# EAGLE design mini-v1.3 (EAGLE 7.2.0)

## Sheet 1 of 4: Main Microcontroller
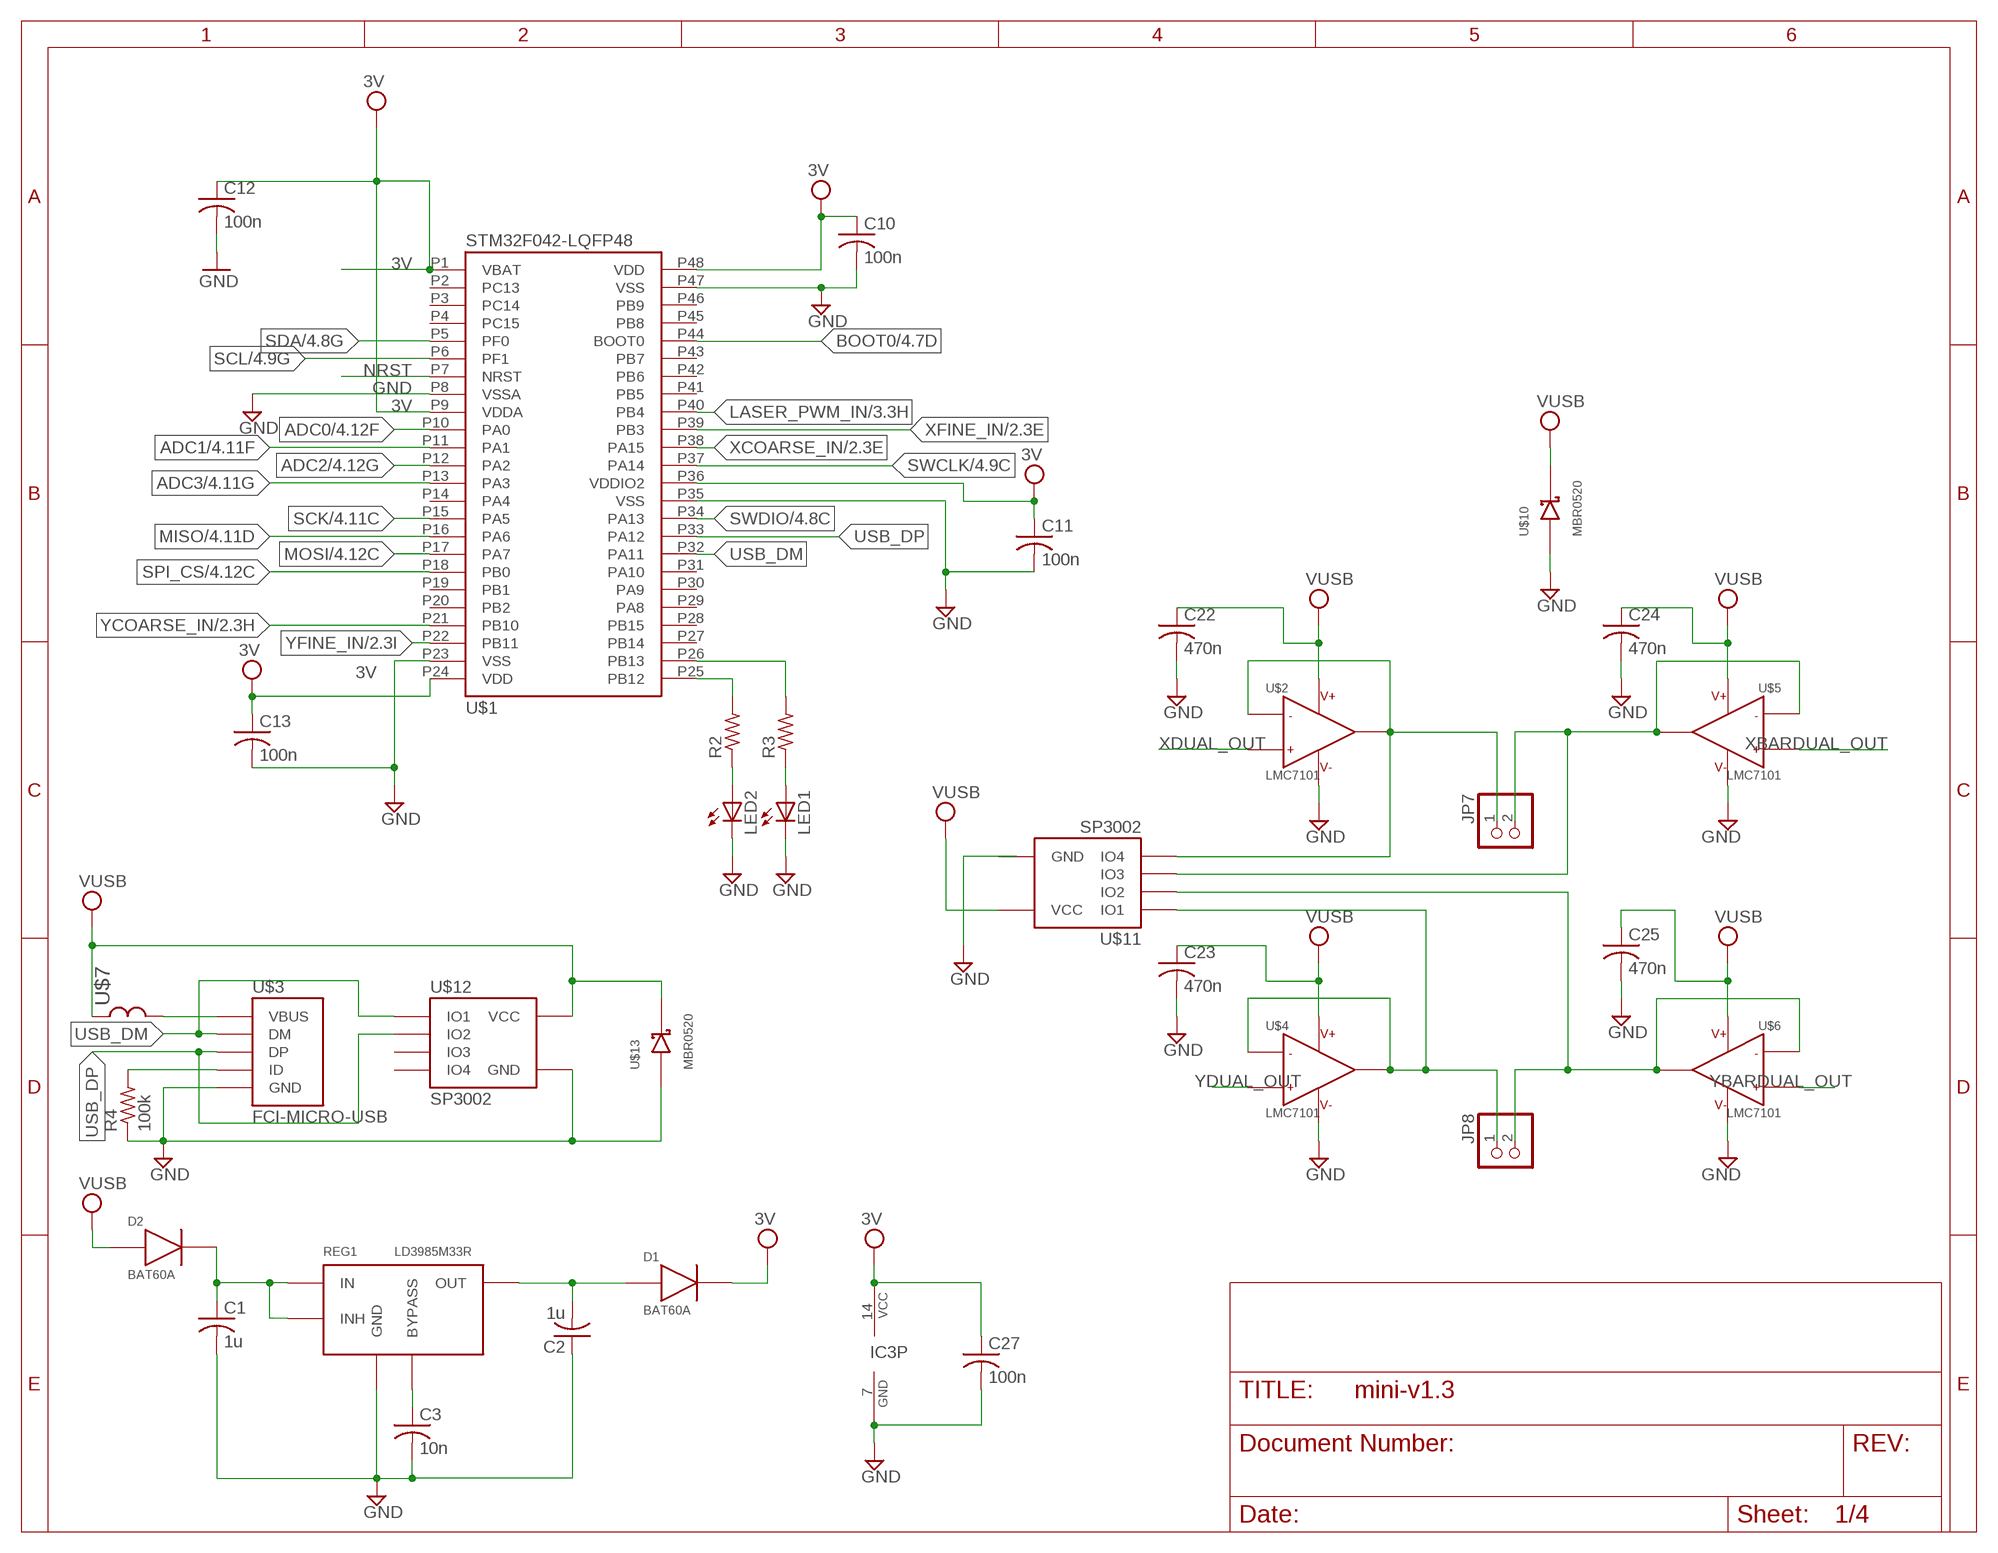
[diagram p0: schematic, sheet 1]

### Parts
C1  1u  C-USC0603  [C0603]
C2  1u  C-USC0603  [C0603]
C3  10n  C-USC0603  [C0603]
C10  100n  C-USC0603  [C0603]
C11  100n  C-USC0603  [C0603]
C12  100n  C-USC0603  [C0603]
C13  100n  C-USC0603  [C0603]
C22  470n  C-USC0603  [C0603]
C23  470n  C-USC0603  [C0603]
C24  470n  C-USC0603  [C0603]
C25  470n  C-USC0603  [C0603]
C27  100n  C-USC0603  [C0603]
D1  BAT60A  [SOD323]
D2  BAT60A  [SOD323]
IC3  74S04D  [SO14]
JP7  PINHD-1X2  [1X02]
JP8  PINHD-1X2  [1X02]
LED1  LEDCHIP-LED0603  [CHIP-LED0603]
LED2  LEDCHIP-LED0603  [CHIP-LED0603]
R2  R-US_R0603  [R0603]
R3  R-US_R0603  [R0603]
R4  100k  R-US_R0603  [R0603]
REG1  LD3985M33R  LD3985MXXR  [SOT23-5L]
U$1  STM32F042-LQFP48  [LQFP48]
U$2  LMC7101  [SOT23-5]
U$3  FCI-MICRO-USB  [FCI-MICROUSB]
U$4  LMC7101  [SOT23-5]
U$5  LMC7101  [SOT23-5]
U$6  LMC7101  [SOT23-5]
U$7  L_TDK_1005  [MLK1005]
U$10  MBR0520  [SOD123]
U$11  SP3002  [SC70-6]
U$12  SP3002  [SC70-6]
U$13  MBR0520  [SOD123]

### Nets
3V: C10.1 C11.1 C12.1 C13.1 C27.1 D1.1 IC3.14(P:VCC) U$1.P1(VBAT) U$1.P9(VDDA) U$1.P24(VDD) U$1.P36(VDDIO2) U$1.P48(VDD) ; also sheet 4
3V3: C2.2 D1.2 REG1.OUT
ADC0: U$1.P10(PA0) ; also sheet 4
ADC1: U$1.P11(PA1) ; also sheet 4
ADC2: U$1.P12(PA2) ; also sheet 4
ADC3: U$1.P13(PA3) ; also sheet 4
BOOT0: U$1.P44(BOOT0) ; also sheet 4
GND [Power]: C1.2 C2.1 C3.2 C10.2 C11.2 C12.2 C13.2 C22.2 C23.2 C24.2 C25.2 C27.2 IC3.7(P:GND) LED1.C LED2.C R4.1 REG1.GND U$1.P8(VSSA) U$1.P23(VSS) U$1.P35(VSS) U$1.P47(VSS) U$2.5 U$3.P5(GND) U$4.5 U$5.5 U$6.5 U$10.ANODE U$12.P2(GND) U$13.ANODE ; also sheet 2,3,4
LASER_PWM_IN: U$1.P40(PB4) ; also sheet 3
MISO: U$1.P16(PA6) ; also sheet 4
MOSI: U$1.P17(PA7) ; also sheet 4
N$1: C3.1 REG1.BYPASS
N$2: R2.2 U$1.P25(PB12)
N$3: LED2.A R2.1
N$4: C1.1 D2.1 REG1.IN REG1.INHIBIT(INH)
N$5: R4.2 U$3.P4(ID)
N$7: JP7.1 U$2.1 U$2.4 U$11.P6(IO4)
N$9: JP8.1 U$4.1 U$4.4 U$11.P1(IO1)
N$12: LED1.A R3.1
N$13: R3.2 U$1.P26(PB13)
N$14: U$3.P1(VBUS) U$7.P$2
N$16: JP7.2 U$5.1 U$5.4 U$11.P4(IO3)
N$17: JP8.2 U$6.1 U$6.4 U$11.P3(IO2)
NRST: U$1.P7(NRST) ; also sheet 4
SCK: U$1.P15(PA5) ; also sheet 4
SCL: U$1.P6(PF1) ; also sheet 4
SDA: U$1.P5(PF0) ; also sheet 4
SPI_CS: U$1.P18(PB0) ; also sheet 4
SWCLK: U$1.P37(PA14) ; also sheet 4
SWDIO: U$1.P34(PA13) ; also sheet 4
USB_DM: U$1.P32(PA11) U$3.P2(DM) U$12.P1(IO1)
USB_DP: U$1.P33(PA12) U$3.P3(DP) U$12.P3(IO2)
VUSB [Power]: C22.1 C23.1 C24.1 C25.1 D2.2 U$2.2 U$4.2 U$5.2 U$6.2 U$7.P$1 U$10.CATHODE U$11.P5(VCC) U$12.P5(VCC) U$13.CATHODE ; also sheet 3
XBARDUAL_OUT: U$5.3 ; also sheet 2
XCOARSE_IN: U$1.P38(PA15) ; also sheet 2
XDUAL_OUT: U$2.3 ; also sheet 2
XFINE_IN: U$1.P39(PB3) ; also sheet 2
YBARDUAL_OUT: U$6.3 ; also sheet 2
YCOARSE_IN: U$1.P21(PB10) ; also sheet 2
YDUAL_OUT: U$4.3 ; also sheet 2
YFINE_IN: U$1.P22(PB11) ; also sheet 2
Unconnected: IC3.1(A:I) IC3.2(A:O) IC3.3(B:I) IC3.4(B:O) U$1.P2(PC13) U$1.P3(PC14) U$1.P4(PC15) U$1.P14(PA4) U$1.P19(PB1) U$1.P20(PB2) U$1.P27(PB14) U$1.P28(PB15) U$1.P29(PA8) U$1.P30(PA9) U$1.P31(PA10) U$1.P41(PB5) U$1.P42(PB6) U$1.P43(PB7) U$1.P45(PB8) U$1.P46(PB9) U$12.P4(IO3) U$12.P6(IO4)

## Sheet 2 of 4: Dual PWM
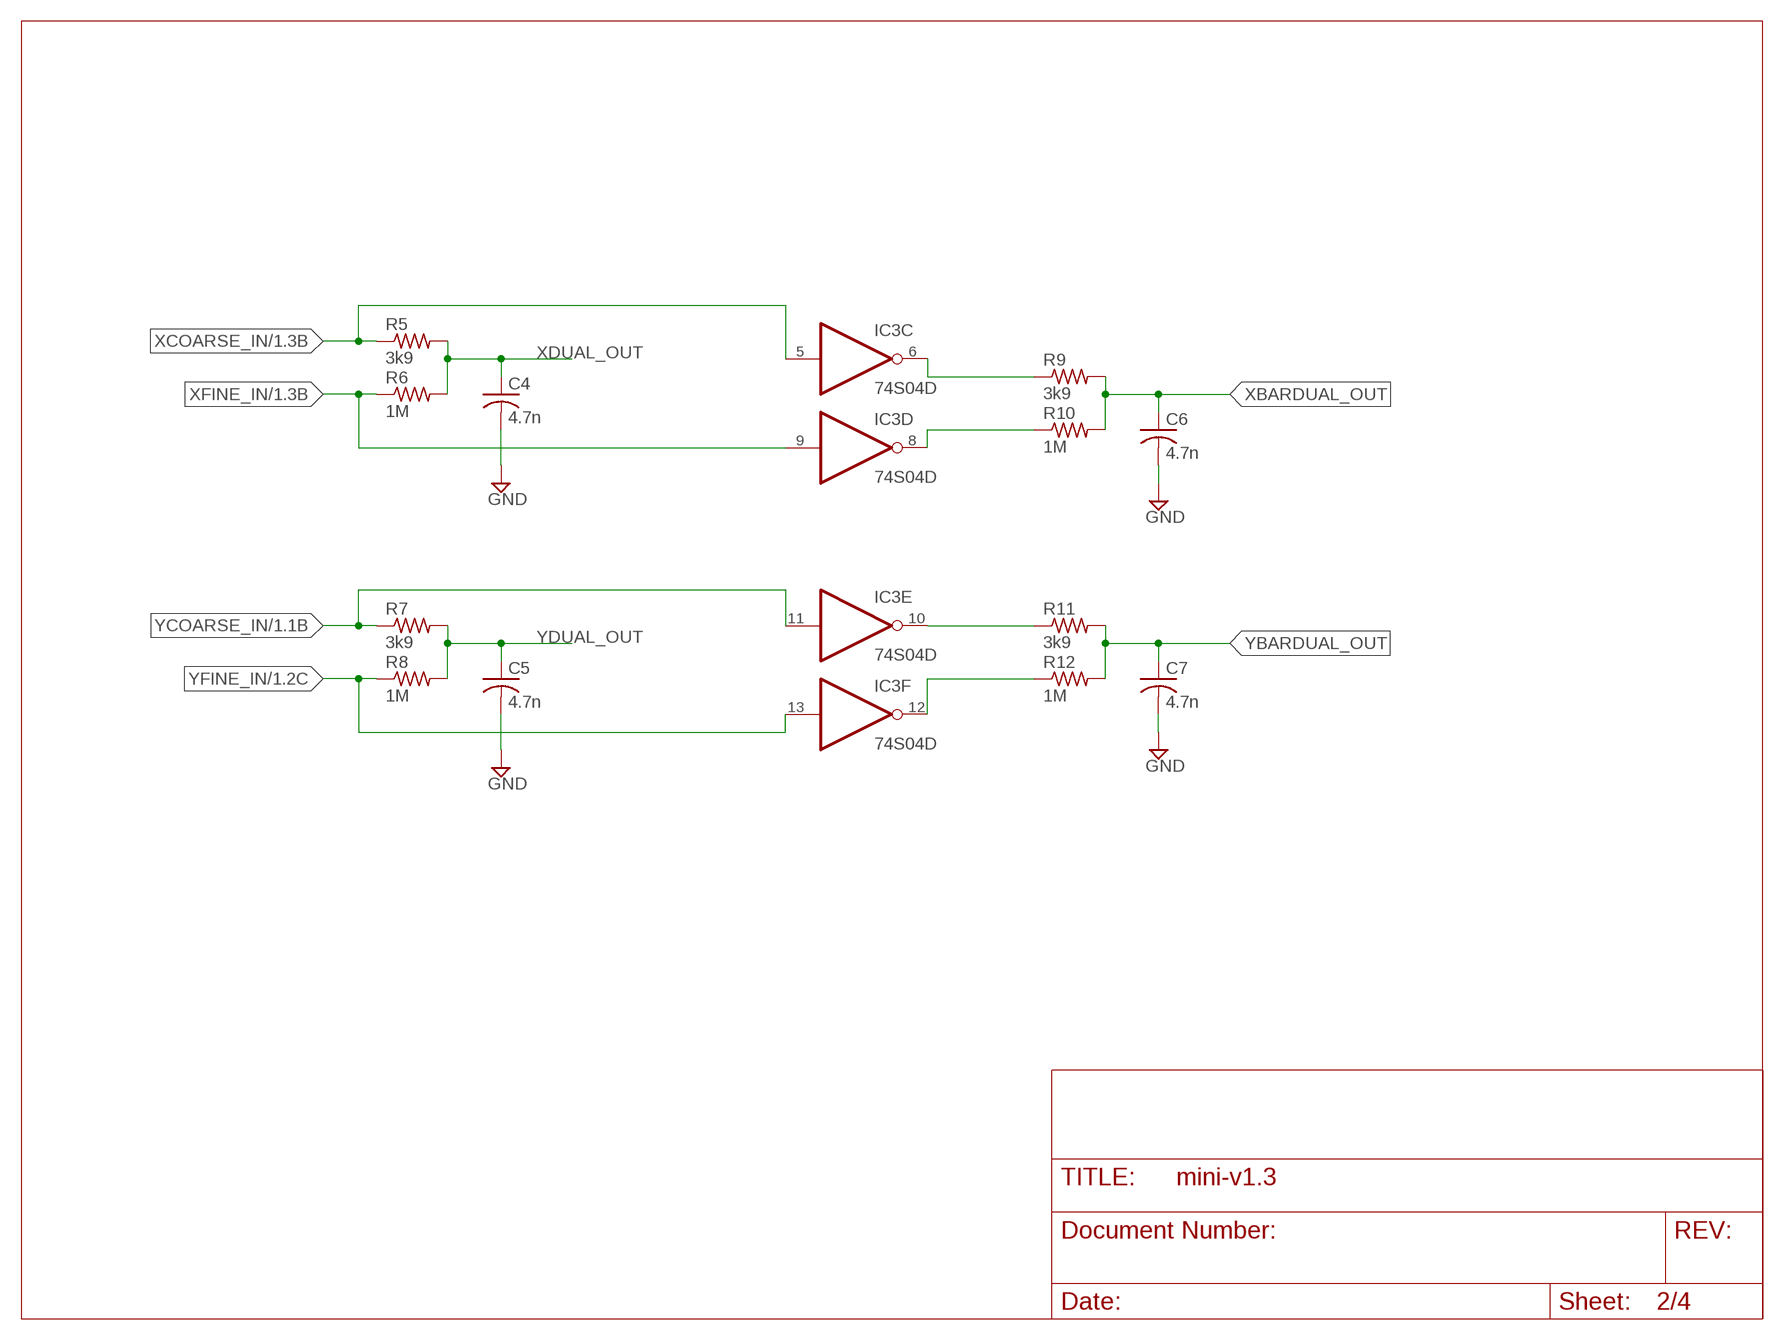
[diagram p1: schematic, sheet 2]

### Parts
C4  4.7n  C-USC0603  [C0603]
C5  4.7n  C-USC0603  [C0603]
C6  4.7n  C-USC0603  [C0603]
C7  4.7n  C-USC0603  [C0603]
R5  3k9  R-US_R0603  [R0603]
R6  1M  R-US_R0603  [R0603]
R7  3k9  R-US_R0603  [R0603]
R8  1M  R-US_R0603  [R0603]
R9  3k9  R-US_R0603  [R0603]
R10  1M  R-US_R0603  [R0603]
R11  3k9  R-US_R0603  [R0603]
R12  1M  R-US_R0603  [R0603]

### Nets
GND [Power]: C4.2 C5.2 C6.2 C7.2 ; also sheet 1,3,4
N$6: IC3.10(E:O) R11.1
N$8: IC3.12(F:O) R12.1
N$10: IC3.8(D:O) R10.1
N$11: IC3.6(C:O) R9.1
XBARDUAL_OUT: C6.1 R9.2 R10.2 ; also sheet 1
XCOARSE_IN: IC3.5(C:I) R5.1 ; also sheet 1
XDUAL_OUT: C4.1 R5.2 R6.2 ; also sheet 1
XFINE_IN: IC3.9(D:I) R6.1 ; also sheet 1
YBARDUAL_OUT: C7.1 R11.2 R12.2 ; also sheet 1
YCOARSE_IN: IC3.11(E:I) R7.1 ; also sheet 1
YDUAL_OUT: C5.1 R7.2 R8.2 ; also sheet 1
YFINE_IN: IC3.13(F:I) R8.1 ; also sheet 1

## Sheet 3 of 4: Laser Power Driver
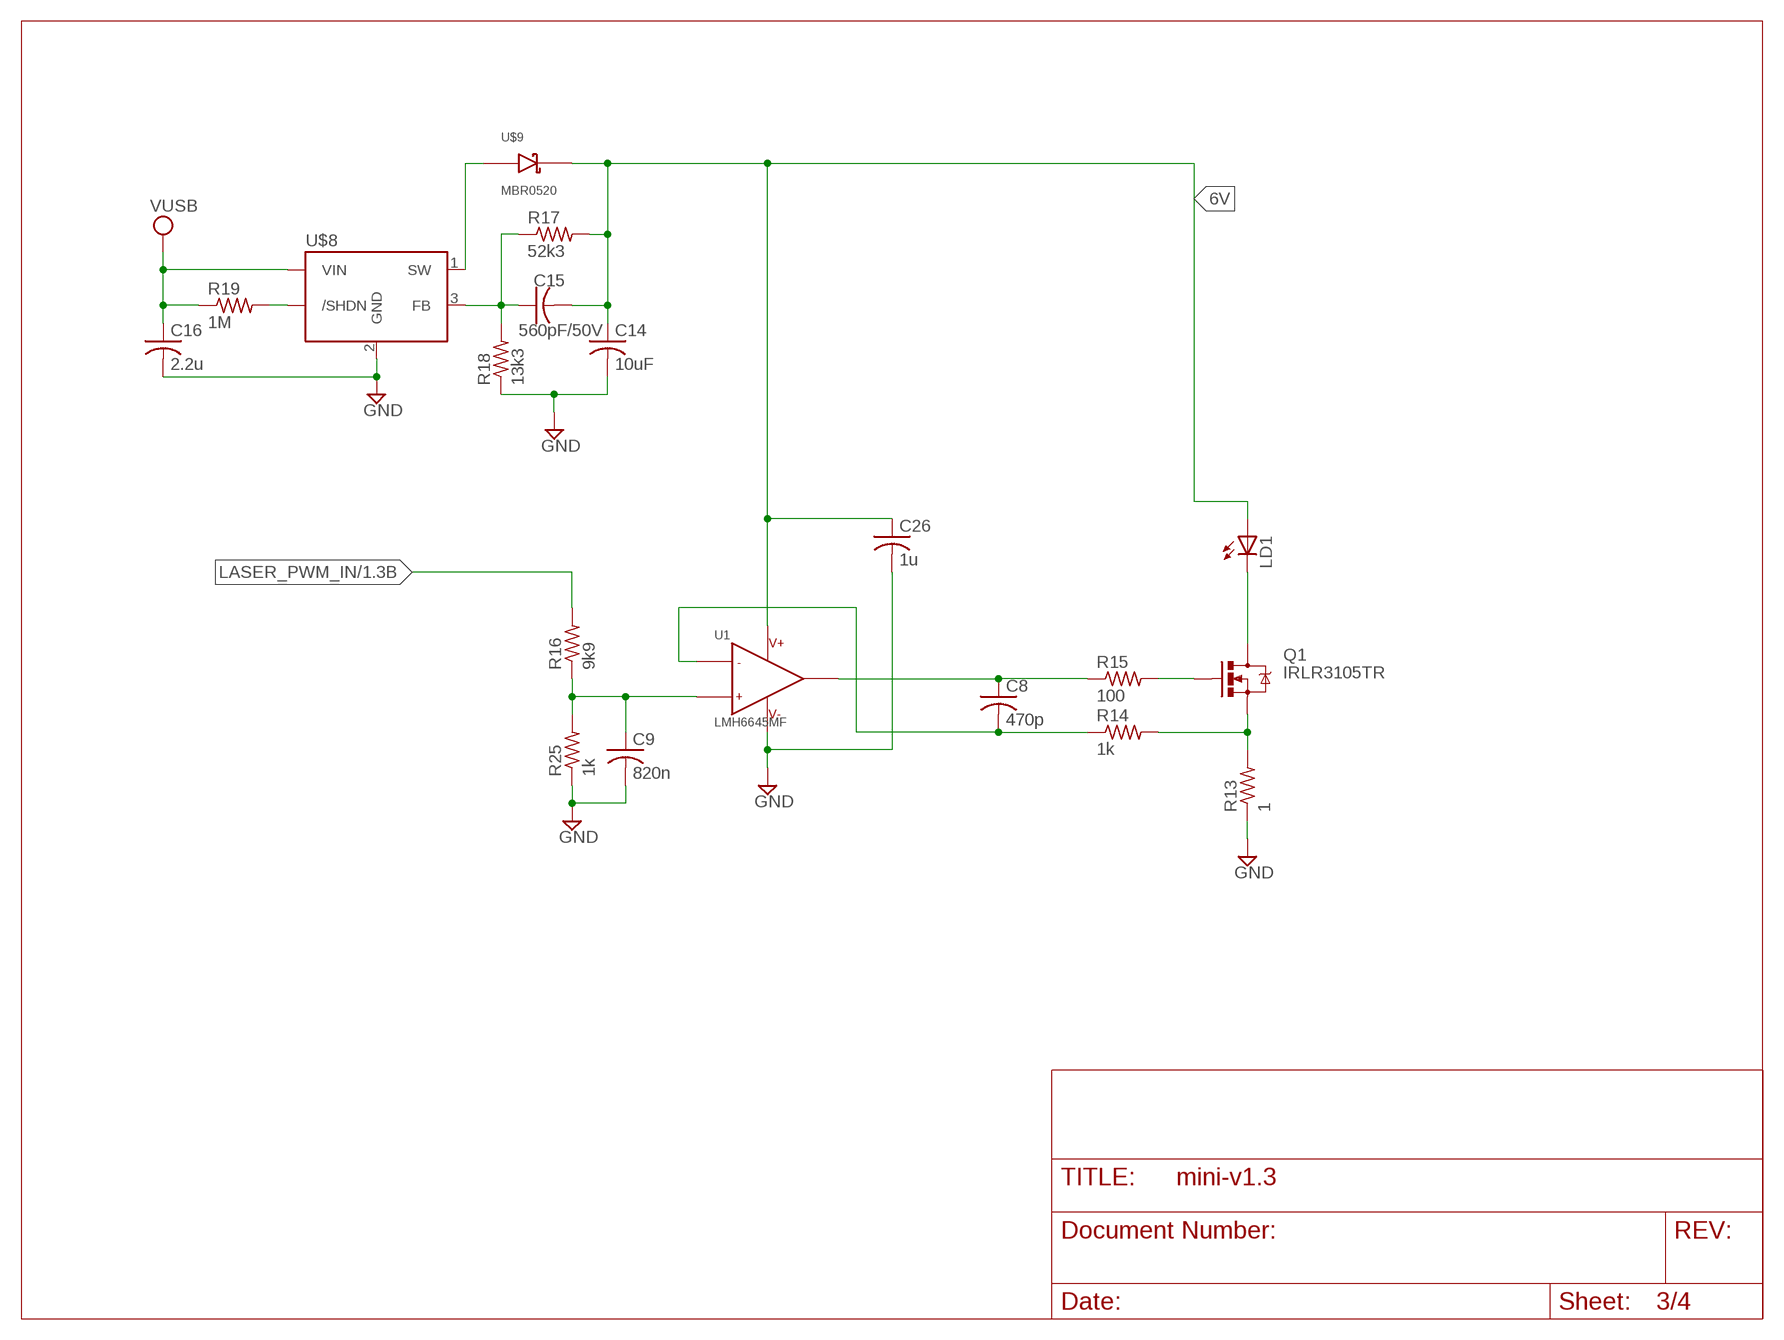
[diagram p2: schematic, sheet 3]

### Parts
C8  470p  C-USC0603  [C0603]
C9  820n  C-USC0603  [C0603]
C14  10uF  C-USC0603  [C0603]
C15  560pF/50V  C-USC0603  [C0603]
C16  2.2u  C-USC0603  [C0603]
C26  1u  C-USC0603  [C0603]
LD1  LASERDIODELD2  [LASERDIODE2]
Q1  IRLR3105TR  FET-N-IRLR3105TRIRLR3105TR  [DPAK]
R13  1  R-US_R0603  [R0603]
R14  1k  R-US_R0603  [R0603]
R15  100  R-US_R0603  [R0603]
R16  9k9  R-US_R0603  [R0603]
R17  52k3  R-US_R0603  [R0603]
R18  13k3  R-US_R0603  [R0603]
R19  1M  R-US_R0603  [R0603]
R25  1k  R-US_R0603  [R0603]
U1  LMH6645MF  OPAMP-SINGLELMH6645MF  [SOT23-5]
U$8  LMR62014  [SOT23-5]
U$9  MBR0520  [SOD123]

### Nets
6V [Power]: C14.1 C15.2 C26.1 LD1.P$1(A) R17.2 U1.5(V+) U$9.CATHODE
GND [Power]: C9.2 C14.2 C16.2 C26.2 R13.1 R18.1 R25.1 U1.2(V-) U$8.2(GND) ; also sheet 1,2,4
LASER_PWM_IN: R16.2 ; also sheet 1
N$15: U$8.1(SW) U$9.ANODE
N$18: LD1.P$3(C) Q1.4(D)
N$19: Q1.3(S) R13.2 R14.2
N$20: C8.2 R14.1 U1.4(IN-)
N$21: Q1.1(G) R15.2
N$22: C8.1 R15.1 U1.1(OUT)
N$23: C9.1 R16.1 R25.2 U1.3(IN+)
N$25: C15.1 R17.1 R18.2 U$8.3(FB)
N$26: R19.2 U$8.4(/SHDN)
VUSB [Power]: C16.1 R19.1 U$8.5(VIN) ; also sheet 1

## Sheet 4 of 4
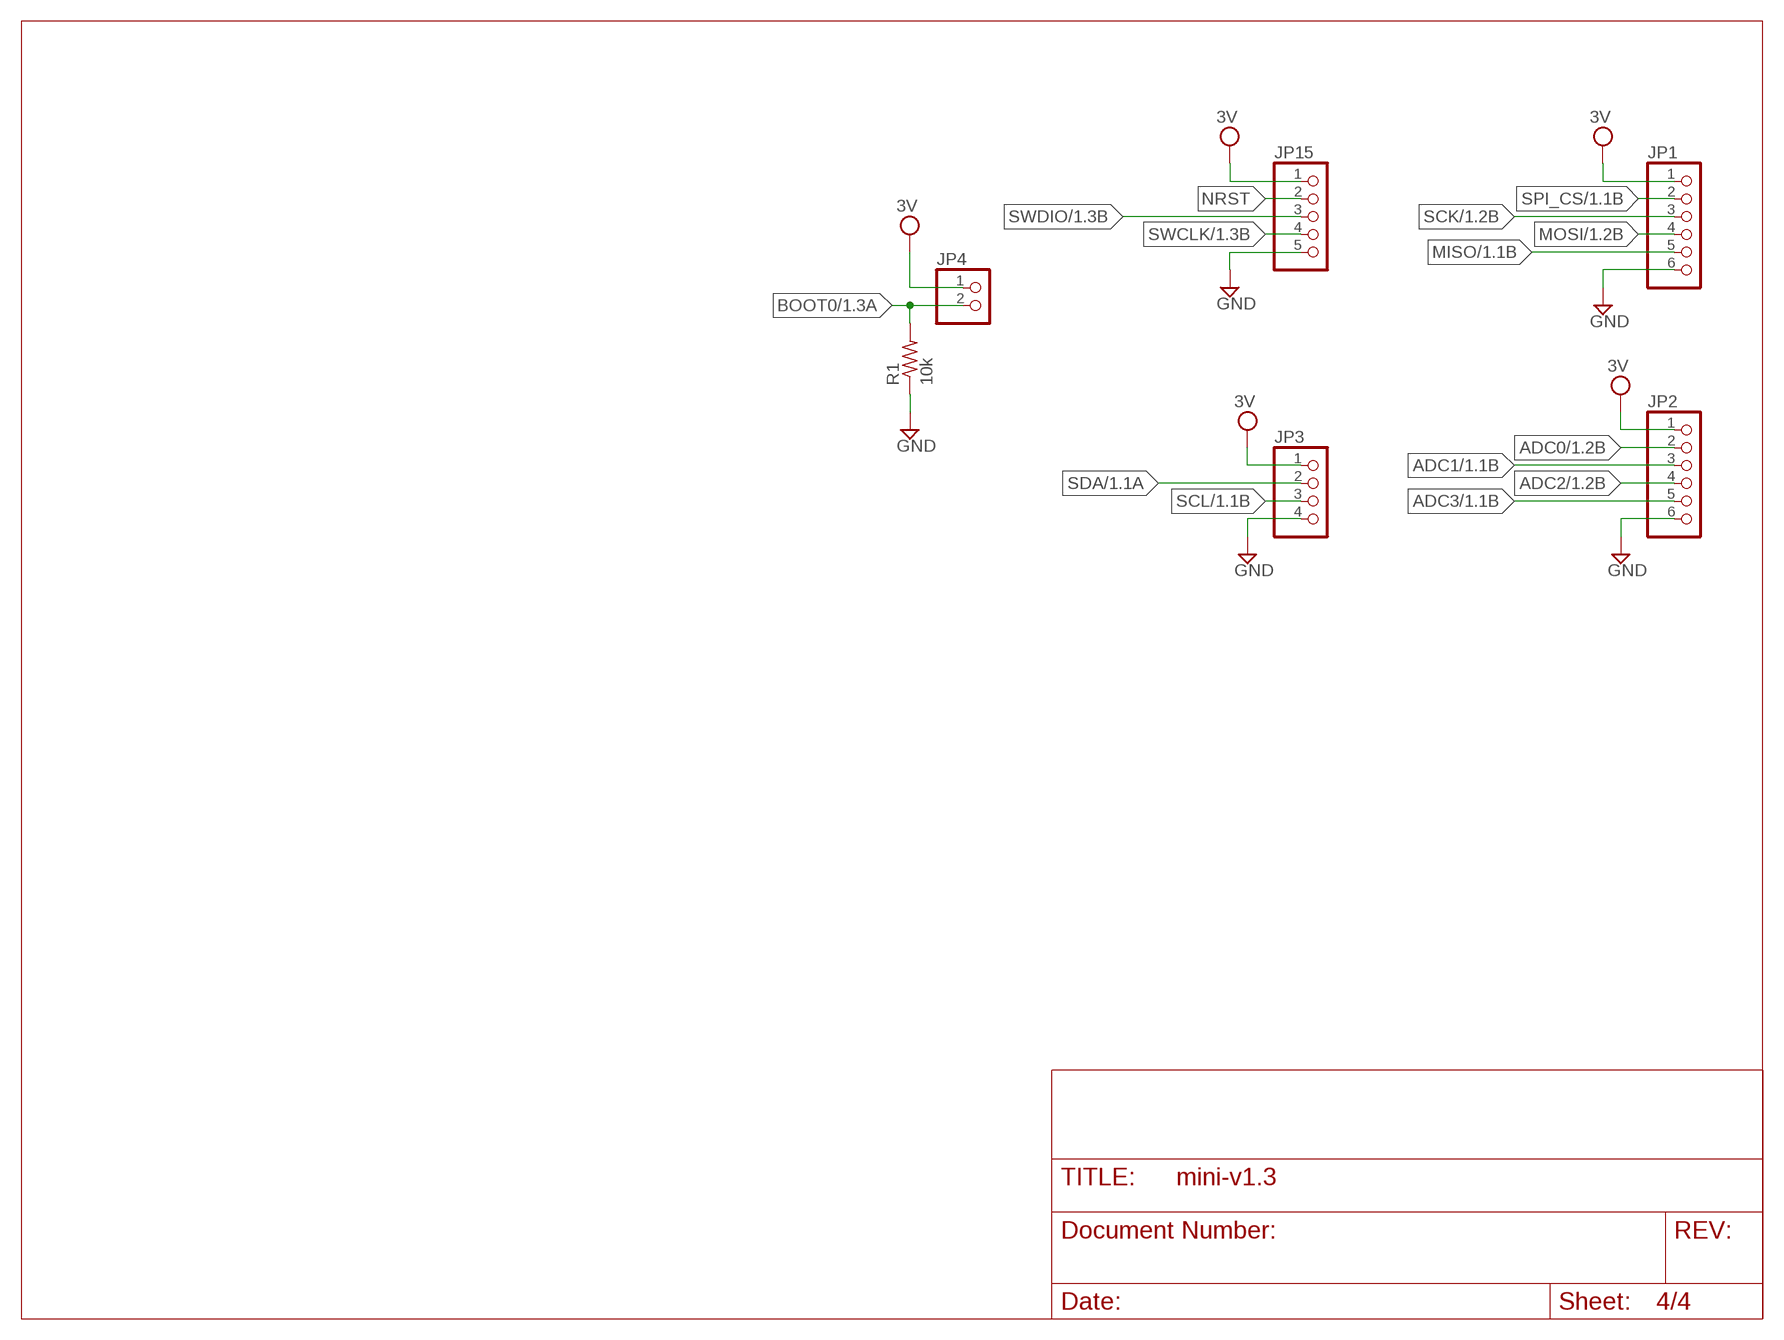
[diagram p3: schematic, sheet 4]

### Parts
JP1  PINHD-1X6  [1X06]
JP2  PINHD-1X6  [1X06]
JP3  PINHD-1X4  [1X04]
JP4  PINHD-1X2  [1X02]
JP15  PINHD-1X5  [1X05]
R1  10k  R-US_R0603  [R0603]

### Nets
3V: JP1.1 JP2.1 JP3.1 JP4.1 JP15.1 ; also sheet 1
ADC0: JP2.2 ; also sheet 1
ADC1: JP2.3 ; also sheet 1
ADC2: JP2.4 ; also sheet 1
ADC3: JP2.5 ; also sheet 1
BOOT0: JP4.2 R1.2 ; also sheet 1
GND [Power]: JP1.6 JP2.6 JP3.4 JP15.5 R1.1 ; also sheet 1,2,3
MISO: JP1.5 ; also sheet 1
MOSI: JP1.4 ; also sheet 1
NRST: JP15.2 ; also sheet 1
SCK: JP1.3 ; also sheet 1
SCL: JP3.3 ; also sheet 1
SDA: JP3.2 ; also sheet 1
SPI_CS: JP1.2 ; also sheet 1
SWCLK: JP15.4 ; also sheet 1
SWDIO: JP15.3 ; also sheet 1

## Power pins joined to a net without a drawn wire
GND: U$11.P2(GND)

## Library data of the parts
C1-C16 C22-C27 = rcl:C-US: CAPACITOR, American symbol
D1 D2 = lmdparts:BAT60A
IC3 = lmdparts:74*04: Hex INVERTER
JP1 JP2 = pinhead:PINHD-1X6: PIN HEADER
JP3 = pinhead:PINHD-1X4: PIN HEADER
JP4 JP7 JP8 = pinhead:PINHD-1X2: PIN HEADER
JP15 = pinhead:PINHD-1X5: PIN HEADER
LD1 = Scott:LASERDIODE; MPN: 3 x (0552-2-15-15-11-27-10-0)
LED1 LED2 = adafruit:LED: LED OSRAM: - CHIPLED LG R971, LG N971, LY N971, LG Q971, LY Q971, LO R971, LY R971 LH N974, LH R974 LS Q976, LO Q976, LY Q976 LO Q996 - Hyper CHIPLED LW Q18S LB Q993, LB Q99A, LB R99A - SideLED LS A670, LO A670, LY A670, LG A670, LP A670 LB A673, LV A673, LT A673, LW A673 LH A674 LY A675 LS A676, LA A676, LO A676, LY A676, LW A676 LS A679, LY A679, LG A679 - Hyper Micro SIDELED® LS Y876, LA Y876, LO Y876, LY Y876 LT Y87S - SmartLED LW L88C, LW L88S LB L89C, LB L89S, LG L890 LS L89K, LO L89K, LY L89K LS L896, LA L896, LO L896, LY L896 - TOPLED LS T670, LO T670, LY T670, LG T670, LP T670 LSG T670, LSP T670, LSY T670, LOP T670, LYG T670 LG T671, LOG T671, LSG T671 LB T673, LV T673, LT T673, LW T673 LH T674 LS T676, LA T676, LO T676, LY T676, LB T676, LH T676, LSB T676, LW T676 LB T67C, LV T67C, LT T67C, LS T67K, LO T67K, LY T67K, LW E67C LS E67B, LA E67B, LO E67B, LY E67B, LB E67C, LV E67C, LT E67C LW T67C LS T679, LY T679, LG T679 LS T770, LO T770, LY T770, LG T770, LP T770 LB T773, LV T773, LT T773, LW T773 LH T774 LS E675, LA E675, LY E675, LS T675 LS T776, LA T776, LO T776, LY T776, LB T776 LHGB T686 LT T68C, LB T68C - Hyper Mini TOPLED® LB M676 - Mini TOPLED Santana® LG M470 LS M47K, LO M47K, LY M47K Source: http://www.osram.convergy.de/
Q1 = lmdparts:FET-N-IRLR3105TR: Common NMOSFET Parts MFG P/N Store ID Prod ID FDD8780 TRANS-09984 SI7820DN TRANS-11055 FDS6630A IC-08089 2N7002PW TRANS-11151 FQP30N06L COM-10213 TRANS-10060 BSS123LT1G TRANS-08345 BSS138 TRANS-00830 BS170 2N7000; PROD_ID: TRANS-09984
R1-R19 R25 = rcl:R-US_: RESISTOR, American symbol
REG1 = lmdparts:LD3985MXXR
U1 = lmdparts:OPAMP-SINGLE: Single amp opamps
U$1 = lmdparts:STM32F042-LQFP48
U$2 U$4-U$6 = lmdparts:LMC7101
U$3 = lmdparts:FCI-MICRO-USB
U$7 = lmdparts:L_TDK_1005
U$8 = lmdparts:LMR62014
U$9 U$10 U$13 = lmdparts:MBR0520
U$11 U$12 = lmdparts:SP3002

## Net classes
1 Power: width 0.305 mm

## Board
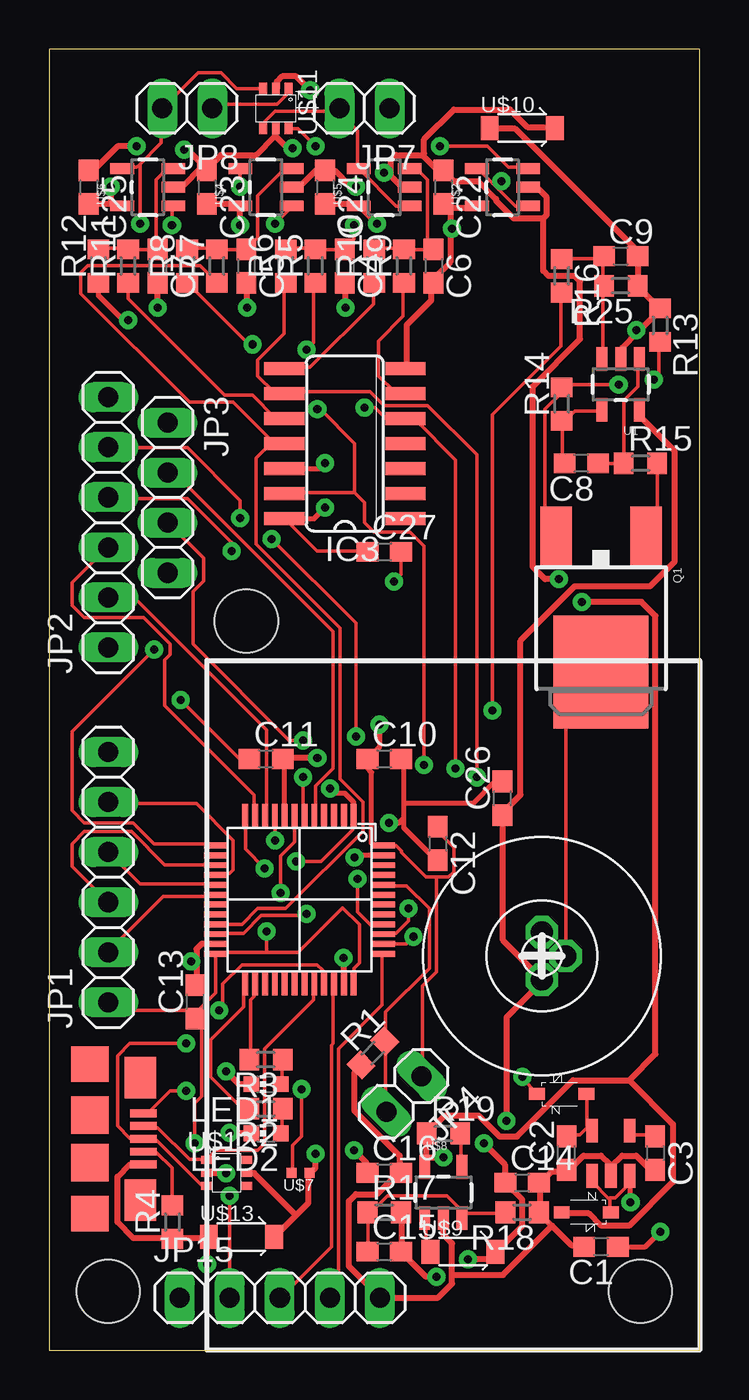
[diagram p4: board, top side]
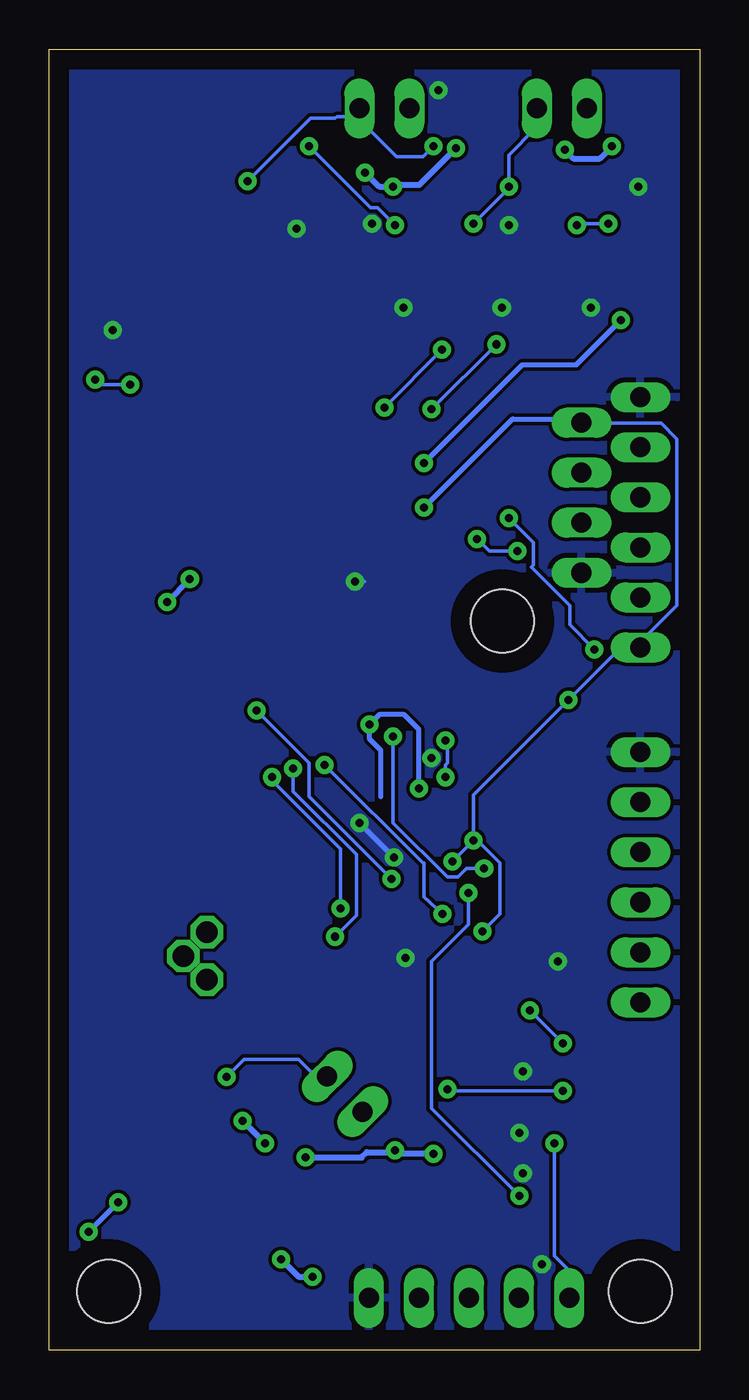
[diagram p5: board, bottom side, seen from below]

Size 33.01 x 66 mm. Coordinates in mm from the lower left corner, seen from the top.
Outline: 0,0 33.01,0 33,66 0,66 0,0
Copper layers (1*16): Top 0.035mm / dielectric 1.5mm / Bottom 0.035mm
Design rules "APCircuitsDRU": minimum track width 7mil, minimum drill 16mil, track to track 7mil, track to pad 7mil, pad to pad 7mil, via to via 7mil, smd to smd 7mil, copper to edge 40mil, drill to drill 12mil, minimum pad ring 10mil, minimum via ring 10mil, stop-mask expansion 2mil, vias tented up to drill 1mil, thermal gap 10mil
Holes 3.2 mm at 30,3 10,37 3,3

### Footprints (pad centres in the part's own frame; a part is rotated, then mirrored left to right if it is on the bottom)
C0603 = smd 1.1 x 1: 1 -0.85,0; 2 0.85,0
SOD323 = smd 0.6 x 0.8: 1 0,1.25; 2 0,-1.25
SO14 = smd 0.66 x 2.032: 1 -3.81,-3.073; 2 -2.54,-3.073; 3 -1.27,-3.073; 4 0,-3.073; 5 1.27,-3.073; 6 2.54,-3.073; 7 3.81,-3.073; 8 3.81,3.073; 9 2.54,3.073; 10 1.27,3.073; 11 0,3.073; 12 -1.27,3.073; 13 -2.54,3.073; 14 -3.81,3.073
1X06 = drill 1.016 long: 1 -6.35,0; 2 -3.81,0; 3 -1.27,0; 4 1.27,0; 5 3.81,0; 6 6.35,0
1X04 = drill 1.016 long: 1 -3.81,0; 2 -1.27,0; 3 1.27,0; 4 3.81,0
1X02 = drill 1.016 long: 1 -1.27,0; 2 1.27,0
1X05 = drill 1.016 long: 1 -5.08,0; 2 -2.54,0; 3 0,0; 4 2.54,0; 5 5.08,0
LASERDIODE2 = drill 1.092 pad 1.499 octagon: P$1 0,1.203; P$2 0,-1.203; P$3 -1.203,0
CHIP-LED0603 = smd 0.8 x 0.8: A 0,-0.75; C 0,0.75
DPAK = smd 1.6 x 3: 1 -2.28,-5.31; 3 2.28,-5.31 | smd 4.826 x 5.715: 4 0,1.588
R0603 = smd 1 x 1.1: 1 -0.85,0; 2 0.85,0
SOT23-5L = smd 0.6 x 1.2: BYPASS -0.95,-1.15; GND 0,1.15; IN 0.95,1.15; INHIBIT -0.95,1.15; OUT 0.95,-1.15
SOT23-5 = smd 0.55 x 1.2: 1 -0.95,-1.3; 2 0,-1.3; 3 0.95,-1.3; 4 0.95,1.3; 5 -0.95,1.3
LQFP48 = smd 0.3 x 1.2: P1 -2.75,-0.6; P2 -2.25,-0.6; P3 -1.75,-0.6; P4 -1.25,-0.6; P5 -0.75,-0.6; P6 -0.25,-0.6; P7 0.25,-0.6; P8 0.75,-0.6; P9 1.25,-0.6; P10 1.75,-0.6; P11 2.25,-0.6; P12 2.75,-0.6; P25 2.75,7.9; P26 2.25,7.9; P27 1.75,7.9; P28 1.25,7.9; P29 0.75,7.9; P30 0.25,7.9; P31 -0.25,7.9; P32 -0.75,7.9; P33 -1.25,7.9; P34 -1.75,7.9; P35 -2.25,7.9; P36 -2.75,7.9 | smd 1.2 x 0.3: P13 4.25,0.9; P14 4.25,1.4; P15 4.25,1.9; P16 4.25,2.4; P17 4.25,2.9; P18 4.25,3.4; P19 4.25,3.9; P20 4.25,4.4; P21 4.25,4.9; P22 4.25,5.4; P23 4.25,5.9; P24 4.25,6.4; P37 -4.25,6.4; P38 -4.25,5.9; P39 -4.25,5.4; P40 -4.25,4.9; P41 -4.25,4.4; P42 -4.25,3.9; P43 -4.25,3.4; P44 -4.25,2.9; P45 -4.25,2.4; P46 -4.25,1.9; P47 -4.25,1.4; P48 -4.25,0.9
FCI-MICROUSB = smd 0.4 x 1.35: P1 -1.3,2.7; P2 -0.65,2.7; P3 0,2.7; P4 0.65,2.7; P5 1.3,2.7 | smd 1.8 x 1.9: P$1 3.8,0; P$2 -3.8,0 | smd 1.9 x 1.9: P$3 -1.2,0; P$4 1.2,0 | smd 2.1 x 1.6: P$5 -3.1,2.55; P$6 3.1,2.55
MLK1005 = smd 0.5 x 0.5: P$1 -0.45,0; P$2 0.45,0
SOD123 = smd 0.91 x 1.22: ANODE -1.65,0; CATHODE 1.65,0
SC70-6 = smd 0.4 x 0.6: P1 -0.65,-1; P2 0,-1; P3 0.65,-1; P4 0.65,1; P5 0,1; P6 -0.65,1

### Placement (x,y rotation side)
C1  28,5.25 180 top
C2  26.25,10 90 top
C3  30.75,10 270 top
C4  15,55 270 top
C5  10,55 270 top
C6  19.5,55 270 top
C7  5.5,55 270 top
C8  27,45 180 top
C9  29,55.5 0 top
C10  17,30 0 top
C11  11,30 0 top
C12  19.71,25.71 270 top
C13  7.43,17.68 90 top
C14  24,8.5 0 top
C15  17,5 0 top
C16  17,9 0 top
C22  20,59 270 top
C23  8,59 270 top
C24  14,59 270 top
C25  2,59 270 top
C26  23,28 90 top
C27  17,40.5 0 top
D1  26,13 90 top
D2  27.25,7 270 top
IC3  15,46 90 top
JP1  3,24 90 top
JP2  3,42 90 top
JP3  6,43.25 270 top
JP4  18,13 225 top
JP7  16,63 180 top
JP8  7,63 180 top
JP15  11.7,2.65 0 top
LD1  25,20 180 top
LED1  11,13.5 90 top
LED2  11,11 90 top
Q1  28,36 180 top
R1  16.43,15.07 45 top
R2  11,12.25 180 top
R3  11,14.75 180 top
R4  6.25,6.5 90 top
R5  13.5,55 90 top
R6  12,55 90 top
R7  8.5,55 90 top
R8  7,55 90 top
R9  18,55 90 top
R10  16.5,55 90 top
R11  4,55 90 top
R12  2.5,55 90 top
R13  31,52 270 top
R14  26,48 90 top
R15  30,45 0 top
R16  26,54.5 270 top
R17  17,7 0 top
R18  24,7 180 top
R19  20,11 0 top
R25  29,54 180 top
REG1  28.5,10 180 top
U1  29,49 180 top
U$1  12.7,26.51 180 top
U$2  23,59 90 top
U$3  2.07,10.72 270 top
U$4  11,59 90 top
U$5  17,59 90 top
U$6  5,59 90 top
U$7  12.75,9 180 top
U$8  20,8 0 top
U$9  21,5 0 top
U$10  24,62 0 top
U$11  11.5,63 180 top
U$12  9,9 270 top
U$13  9.75,5.75 0 top

### Tracks (layer width: path | path; a pad name or v marks a point on that pad's centre or on a via)
3V  (via drill 0.41)
  Top 0.178: v11.47,25.87 11.47,27.03 U$1.P9 | v12.54,24.8 13.78,24.8 15.38,26.4 15.38,27.03 U$1.P1 | v6.67,32.98 9.6,30.05 10.13,30.05 C11.1 | C13.1 7.47,16.89 7.47,17.16 8.45,18.14 8.45,20.09 U$1.P24 8.53,20.18 11.02,20.18 | C13.1 7.47,17.25 3.38,17.25 3.02,17.6 JP1.1 | v7.38,10.49 7.38,12.54 7.73,12.89 7.73,16.54 7.47,16.8 C13.1 | v24,13.87 24,13.78 24.71,13.07 D1.1 | C27.1 16.09,40.54 13.6,40.54 12,42.14 IC3.14 | 19.65,24 19.11,24 17.87,25.25 17.87,25.34 17.6,25.6 16.98,25.6 U$1.P48 16.8,25.69 16.36,25.69 | 19.65,24 20.27,24 20.54,24.27 20.54,25.51 19.74,26.31 19.74,26.49 C12.1 | U$1.P36 15.47,18.67 15.47,19.38 15.73,19.65 15.73,21.6 14.89,22.45 12.62,20.18 11.02,20.18 | 19.65,24 19.65,19.2 18.94,18.49 18.94,13.96 JP4.1 | 11.02,20.18 v11.02,21.25
  Top 0.254: U$1.P1 15.45,27.8 15,28.25 14.5,28.25 v14.25,28.5 | v16.75,31.75 16.75,30.6 C10.1 16.15,29.53 16.36,29.32 16.36,25.69 | IC3.14 13.44,42.19 v14,42.75
  Bottom 0.178: v12.54,24.8 v11.47,25.87 | JP3.1 5.96,47.03 1.96,47.03 1.16,46.23 1.16,37.78 2.93,36.01 2.93,35.74 JP2.1 3.02,35.65 4,35.65 v6.67,32.98 11.47,28.18 v11.47,25.87 | v7.38,10.49 7.38,4.8 6.67,4.09 6.67,2.67 JP15.1 | v24,13.87 23.11,14.76 20.36,14.76 19.56,13.96 18.94,13.96 JP4.1 | v11.02,21.25 10.13,22.14 10.13,24.71 11.2,25.78 11.47,25.78 v11.47,25.87
  Bottom 0.254: v14.25,28.5 14.25,31.5 15,32.25 16.25,32.25 v16.75,31.75 16.75,31 16.18,30.43 16.18,28.09 | v14,42.75 9.5,47.25 6.19,47.25 JP3.1
3V3
  Top 0.178: D1.2 27.29,12.98 27.29,11.38 27.47,11.2 REG1.OUT 27.29,11.29 26.94,10.94 26.31,10.94 C2.2
6V  (via drill 0.41)
  Top 0.305: R17.2 17.87,6.93 17.87,5.07 C15.2 17.96,4.89 19.11,3.73 v19.65,3.73 | v21.25,4.62 22.31,4.62 22.58,4.89 U$9.CATHODE 22.67,4.98 24,6.31 24,7.64 23.2,8.45 C14.1 23.11,8.62 23.11,9.42 v22.05,10.49 | U1.5 29.96,47.65 29.96,47.38 31.74,45.61 31.74,40.01 30.49,38.76 26.67,38.76 23.91,36.01 23.91,28.18 23.02,27.29 C26.1 23.02,27.11 23.02,20.8 24.98,18.85 LD1.P$1 24.98,18.67 23.2,16.89 v23.2,11.65
  Bottom 0.305: v19.65,3.73 20.36,3.73 v21.25,4.62 | v23.2,11.65 v22.05,10.49
ADC0
  Top 0.178: U$1.P10 11.02,27.11 11.02,31.47 4.36,38.14 3.02,38.14 JP2.2
ADC1
  Top 0.178: U$1.P11 10.4,27.11 10.4,28.18 5.87,32.72 5.87,35.03 6.13,35.29 6.13,35.83 4.8,37.16 1.78,37.16 1.16,37.78 1.16,38.94 2.93,40.72 JP2.3
ADC2  (via drill 0.41)
  Top 0.178: v10.94,24.45 9.96,25.43 9.96,27.03 U$1.P12 | v15.56,31.14 15.56,36.89 v11.29,41.16 | v9.25,40.54 9.25,40.98 7.02,43.2 3.02,43.2 JP2.4
  Bottom 0.178: v10.94,24.45 11.82,24.45 12.27,24 12.8,24 15.56,26.76 v15.56,31.14 | v11.29,41.16 10.67,40.54 v9.25,40.54
ADC3  (via drill 0.41)
  Top 0.178: v5.33,35.56 1.16,31.38 1.16,27.38 1.78,26.76 4.27,26.76 5.33,25.69 8.45,25.69 U$1.P13 | v9.69,42.23 9.69,43.12 7.02,45.78 3.02,45.78 JP2.5
  Bottom 0.178: v5.33,35.56 6.58,36.8 6.58,37.78 8.53,39.74 8.45,39.83 8.45,40.98 v9.69,42.23
BOOT0
  Top 0.178: JP4.2 17.07,12.18 17.07,15.65 R1.2 17.07,15.73 17.07,17.16 19.29,19.38 19.29,22.4 18.14,23.56 16.98,23.56 U$1.P44
GND  (via drill 0.41)
  Top 0.178: C27.2 17.85,39.35 v17.5,39
  Top 0.254: U$1.P8 11.95,29.9 C11.2 | C12.2 19.64,24.86 18,26.5 18,27 | 18,27 18,27.75 | 18,27.75 18,29.85 C10.2 | C26.2 22.6,28.85 21.5,27.75 18,27.75 | U$1.P47 15.61,25.11 v15.5,25 | v17.25,26.75 17.75,26.75 18,27
  Top 0.305: 17.87,40.45 C27.2 | 29.87,51.65 30.94,52.72 R13.1 30.94,52.9 29.87,53.96 R25.1 29.87,54.05 29.87,55.47 C9.2 29.78,55.56 29.78,55.83 23.65,61.96 22.4,61.96 U$10.ANODE | 29.87,51.65 29.07,50.85 29.07,50.32 U1.2 | 20.36,56.9 20.36,57.78 C22.2 20.36,57.96 21.69,57.96 U$2.5 | 20.36,56.9 20.36,55.21 19.56,54.41 19.56,54.23 C6.2 19.38,54.05 19.38,53.25 18.14,52.01 18.14,49.87 IC3.7 | C3.2 30.67,9.16 30.49,9.16 29.78,9.87 29.07,9.87 28.54,9.34 28.54,8.89 REG1.GND 28.45,9.42 28,9.87 27.11,9.87 26.4,9.16 C2.1 26.23,9.07 25.51,9.07 24.98,8.53 C14.2 24.89,8.45 24.89,7.02 R18.1 24.89,6.93 25.51,6.31 | 25.51,6.31 26.49,5.33 27.11,5.33 C1.2 | U$3.P5 4.71,9.42 4.09,9.42 3.47,8.8 3.47,6.49 4.27,5.69 6.13,5.69 R4.1 6.31,5.69 8.09,5.69 U$13.ANODE 8,5.6 v8,4.36 | R1.1 15.82,14.4 15.47,14.05 15.47,12.18 17.78,9.87 17.78,9.07 C16.2 17.69,8.98 16.62,7.91 15.56,7.91 15.2,7.56 15.2,4.27 16.71,2.76 JP15.5 16.8,2.67 19.74,2.67 20.45,3.38 20.45,3.82 | 7.47,19.74 7.47,20.36 7.73,20.62 8.45,20.62 U$1.P23 | 7.47,19.74 7.47,18.58 C13.2 | C24.2 14.05,58.14 15.56,58.14 15.65,58.05 U$5.5 15.82,57.96 v16.62,57.16 | C23.2 9.6,58.14 U$4.5 9.69,57.96 v9.69,57.07 | C25.2 2.04,58.14 3.56,58.14 3.65,58.05 U$6.5 3.11,58.23 v3.11,59.03 | v8.98,8.98 8,8.98 U$12.P2 | v13.25,63.92 12.54,64.63 11.82,64.63 11.56,64.36 11.56,64.01 U$11.P2 | v9.16,11.02 10.22,11.02 LED2.C | v8.98,14.13 9.6,13.51 10.22,13.51 LED1.C | v13.6,30.05 11.91,30.05 C11.2 | v5.51,52.9 5.51,54.14 C7.2 | v10.05,52.9 10.05,54.14 C5.2 | v15.02,52.9 15.02,54.14 C4.2 | 20.45,3.82 20.45,5.42 20,5.87 20,6.67 U$8.2 | v14.94,19.91 14.94,18.67 U$1.P35
  Top 0.305: v7.2,19.74 7.47,19.74 | 25.51,6.31 23.02,3.82 20.45,3.82 | v20.45,56.9 20.36,56.9 | v29.78,51.74 29.87,51.65
  Bottom 0.178: v17.5,39 17,39
  Bottom 0.254: v15.5,25 v17.25,26.75
  pour Bottom: 0,0 33,0 33,66 0,66
LASER_PWM_IN  (via drill 0.41)
  Top 0.178: v22.49,32.45 22.49,47.47 25.96,50.94 25.96,53.61 R16.2 | v15.65,23.91 15.65,22.23 16.27,21.6 16.89,21.6 U$1.P40
  Bottom 0.178: v22.49,32.45 19.82,29.78 19.82,28.09 v15.65,23.91
MISO
  Top 0.178: U$1.P16 8.53,24.18 9.16,24.18 9.34,24.36 9.34,25.87 7.47,27.74 3.02,27.74 JP1.5
MOSI
  Top 0.178: U$1.P17 8.45,23.65 4.62,23.65 3.02,25.25 JP1.4
N$1
  Top 0.178: C3.1 30.67,10.94 29.69,10.94 29.52,11.11 REG1.BYPASS
N$2
  Top 0.178: R2.2 10.13,12.27 9.78,12.27 8.18,13.87 8.18,15.73 9.87,17.42 9.87,18.58 U$1.P25
N$3
  Top 0.178: LED2.A 11.82,11.02 11.82,12.18 R2.1
N$4  (via drill 0.41)
  Top 0.178: 28.4,7.69 27.56,8.53 27.56,8.8 REG1.IN | 28.4,7.69 28.45,7.64 28.45,7.02 D2.1 | REG1.INHIBIT 29.43,8.8 29.43,8.45 28.71,7.73 28.45,7.73 28.4,7.69
  Top 0.254: C1.1 30.25,5.25 v31,6 | v29.5,7.5 29.5,8.8 REG1.INHIBIT
  Bottom 0.254: v31,6 v29.5,7.5
N$5
  Top 0.178: R4.2 6.22,7.38 6.22,9.25 5.42,10.05 4.8,10.05 U$3.P4
N$6
  Top 0.178: R11.1 4,53.34 8.89,48.45 10.31,48.45 11.47,47.3 11.91,47.3 IC3.10
N$7  (via drill 0.41)
  Top 0.178: 22.71,58.98 21.78,59.92 U$2.4 | 22.71,58.98 23.65,58.05 24.27,58.05 U$2.1 | v13.51,61.07 12.62,61.96 12.18,61.96 U$11.P6 | 22.71,58.98 22.94,59.21 v22.94,59.3
  Bottom 0.178: v13.51,61.07 14.05,60.54 15.38,60.54 17.25,62.41 17.25,62.59 | 17.25,62.59 17.25,62.94 JP7.1 17.25,62.59 | v22.94,59.3 19.74,62.5 18.49,62.5 18.4,62.59 17.25,62.59
N$8  (via drill 0.41)
  Top 0.254: IC3.12 13.73,44.73 v14,45 | v4,52.25 3.75,52.25 2.5,53.5 R12.1
  Bottom 0.254: v14,45 9,50 6.25,50 v4,52.25
N$9  (via drill 0.41)
  Top 0.178: U$11.P1 12.09,63.92 12.09,63.74 11.56,63.21 8.53,63.21 8.36,63.03 JP8.1 | v9.69,59.03 9.69,59.92 U$4.4 | v11.47,57.16 12.27,57.96 U$4.1
  Bottom 0.178: JP8.1 8.36,62.94 8.36,61.96 9.69,60.63 v9.69,59.03 9.69,58.94 v11.47,57.16
N$10
  Top 0.178: R10.1 16.45,54.14 16.45,53.07 13.25,49.87 12,49.87 IC3.8
N$11
  Top 0.178: R9.1 17.96,54.14 17.96,52.45 16.71,51.21 16.71,49.43 17.51,48.63 18.05,48.63 IC3.6
N$12
  Top 0.178: LED1.A 11.82,13.51 11.82,14.67 R3.1
N$13
  Top 0.178: R3.2 10.22,14.76 10.22,17.78 10.4,17.96 10.4,18.58 U$1.P26
N$14  (via drill 0.41)
  Top 0.178: v12.8,13.25 12.8,10.85 12.36,10.4 12.36,9.07 U$7.P$2 | v6.93,13.16 6.13,13.16 5.07,12.09 4.8,12.09 U$3.P1
  Bottom 0.178: v12.8,13.25 12.71,13.16 v6.93,13.16
N$15
  Top 0.178: U$8.1 19.11,6.67 19.11,5.25 19.29,5.07 U$9.ANODE
N$16
  Top 0.178: U$11.P4 10.94,62.05 10.94,62.32 11.47,62.85 14.58,62.85 14.67,62.94 JP7.2 14.67,62.85 15.65,61.87 15.65,60.01 U$5.4 15.73,59.92 17.6,58.05 18.22,58.05 U$5.1
N$17  (via drill 0.41)
  Top 0.178: U$11.P3 9.51,64.01 8.71,64.81 7.56,64.81 5.78,63.03 JP8.2 5.69,62.94 5.69,61.25 4.58,60.14 | 4.58,60.14 4.45,60.01 3.73,60.01 U$6.4 | v6.22,57.07 6.22,57.96 U$6.1 | v4.62,57.16 4.62,60.1 4.58,60.14
  Bottom 0.178: v6.22,57.07 6.13,57.16 v4.62,57.16
N$18
  Top 0.178: LD1.P$3 26.23,20 26.23,32.72 27.91,34.4 Q1.4
N$19  (via drill 0.41)
  Top 0.178: Q1.3 25.69,41.34 25.16,41.87 25.16,47.74 25.96,48.54 25.96,48.81 R14.2 26.05,48.9 26.14,48.98 v28.89,48.98 | v30.67,49.25 30.94,49.52 30.94,51.12 R13.2
  Bottom 0.178: v30.67,49.25 30.4,48.98 v28.89,48.98
N$20
  Top 0.178: C8.2 26.14,45.07 26.05,45.16 26.05,47.12 R14.1 26.14,47.12 26.67,47.65 28,47.65 U1.4
N$21
  Top 0.178: R15.2 30.85,44.98 30.85,41.87 30.32,41.34 Q1.1
N$22
  Top 0.178: C8.1 27.91,44.98 29.07,44.98 R15.1 29.16,45.07 29.16,48.18 29.87,48.9 29.87,50.23 U1.1
N$23
  Top 0.178: R16.1 26.05,55.38 28,55.38 28.09,55.47 C9.1 28.09,55.38 28.09,54.05 R25.2 28.09,53.96 28.09,50.32 U1.3
N$25
  Top 0.178: C15.1 16.18,5.07 16.18,6.93 R17.1 16.27,6.93 17.16,7.82 20.18,7.82 21.07,6.93 U$8.3 20.98,6.76 21.16,6.93 23.11,6.93 R18.2
N$26
  Top 0.178: R19.2 20.89,10.94 20.89,9.34 U$8.4
NRST  (via drill 0.41)
  Top 0.178: v11.73,23.2 11.73,25.07 12.45,25.78 12.45,27.03 U$1.P7 | v9.16,7.82 9.16,2.67 JP15.2
  Bottom 0.178: v11.73,23.2 11.73,21.6 13.6,19.74 13.6,12.27 v9.16,7.82
SCK
  Top 0.178: U$1.P15 8.45,24.62 5.87,24.62 4.18,26.31 1.78,26.31 1.16,25.69 1.16,24.54 2.93,22.76 JP1.3
SCL  (via drill 0.41)
  Top 0.178: v12.89,29.07 12.89,27.11 U$1.P6 | v12.89,30.94 12.18,30.94 7.29,35.83 7.29,38.49 7.82,39.03 7.82,40.18 6.04,41.96 JP3.3
  Bottom 0.178: v12.89,29.07 12.89,29.69 12.8,29.78 12.8,30.85 v12.89,30.94
SDA
  Top 0.178: U$1.P5 13.51,27.11 13.51,28.63 14.4,29.52 14.4,36.45 6.4,44.45 6.04,44.45 JP3.2
SPI_CS
  Top 0.178: U$1.P18 8.45,23.02 5.78,23.02 3.02,20.27 JP1.2
SWCLK
  Top 0.178: U$1.P37 16.89,20.09 16.89,17.51 14.67,15.29 14.67,3.02 14.31,2.67 JP15.4
SWDIO
  Top 0.178: U$1.P34 14.4,18.58 14.4,15.56 14.31,15.47 14.31,5.25 11.73,2.67 JP15.3
USB_DM
  Top 0.178: U$3.P2 4.8,11.29 5.51,11.29 7.11,9.69 7.91,9.69 U$12.P1 8,9.69 8.45,10.13 10.58,10.13 10.94,10.49 10.94,15.29 13.42,17.78 13.42,18.58 U$1.P32
USB_DP  (via drill 0.41)
  Top 0.178: U$12.P3 7.91,8.36 7.73,8.36 5.42,10.67 4.8,10.67 U$3.P3 4.71,10.76 4.09,10.76 3.47,11.38 3.47,14.94 4.09,15.56 v6.93,15.56 | v8.62,17.25 8.8,17.42 8.8,18.58 9.78,19.56 13.6,19.56 13.87,19.29 13.87,18.67 U$1.P33
  Bottom 0.178: v6.93,15.56 v8.62,17.25
VUSB  (via drill 0.41)
  Top 0.305: 11.47,61.61 11.47,61.96 U$11.P5 | 11.47,61.61 10.49,60.63 8.71,60.63 8,59.92 C23.1 | v4.45,61.07 3.47,61.07 2.31,59.92 2.04,59.92 C25.1 | v6.84,60.9 7.02,60.9 7.91,60.01 C23.1 | U$6.2 6.31,59.03 6.76,59.03 7.73,60.01 C23.1 | U$4.2 12.36,59.03 12.71,59.03 13.51,59.83 13.96,59.83 C24.1 14.13,59.83 14.49,59.83 15.29,59.03 v15.56,59.03 | 18.94,60.63 19.65,59.92 19.91,59.92 C22.1 20.09,59.74 20.54,59.3 21.78,59.3 22.67,58.41 22.67,58.32 23.56,57.43 25.07,57.43 | 18.94,60.63 17.6,60.63 17.34,60.36 17.34,59.74 | 17.34,59.74 17.34,59.56 17.87,59.03 18.22,59.03 U$5.2 | 25.07,57.43 25.25,57.61 25.25,58.5 24.8,58.94 24.36,58.94 U$2.2 | U$10.CATHODE 25.6,62.05 24.27,62.05 23.38,62.94 20.54,62.94 19.02,61.43 19.02,60.72 18.94,60.63 | 17.34,59.74 v16.98,59.74 | 11.47,61.61 12.09,60.98 v12.36,60.98 | 12.54,6.84 11.47,5.78 U$13.CATHODE | 12.54,6.84 13.16,7.47 13.16,8.98 U$7.P$1 13.34,9.07 13.51,9.25 v13.51,9.96 | 12.54,6.84 10.4,8.98 10.05,8.98 U$12.P5 | v15.47,10.13 16.09,9.51 16.09,9.07 C16.1 | 29.43,13.69 31.65,11.47 31.65,8.53 29.43,6.31 28,6.31 27.38,6.93 26.05,6.93 D2.2 | 29.43,13.69 26.58,13.69 23.74,10.85 22.85,10.85 21.78,11.91 20.09,11.91 19.2,11.02 R19.1 19.11,10.94 19.11,9.34 U$8.5 19.2,9.78 v20,9.78 | 25.07,57.43 25.07,54.76 25.34,54.5 26.67,54.5 26.94,54.23 26.94,51.3 24.54,48.9 24.54,39.74 25.16,39.12 v25.87,39.12 | v27.03,37.96 30.05,37.96 30.76,37.25 30.76,15.02 29.43,13.69
  Bottom 0.305: v4.45,61.07 5.07,60.45 6.4,60.45 v6.84,60.9 | v16.98,59.74 16.27,59.03 v15.56,59.03 15.47,59.12 14.22,59.12 v12.36,60.98 | v13.51,9.96 15.29,9.96 v15.47,10.13 15.56,10.05 16.89,10.05 17.16,9.78 v20,9.78 | v27.03,37.96 v25.87,39.12
XBARDUAL_OUT
  Top 0.178: R10.2 16.54,55.92 17.96,55.92 R9.2 18.05,55.83 19.2,55.83 | 19.2,55.83 19.47,55.83 C6.1 19.2,55.83 | 19.2,55.83 19.2,59.38 18.67,59.92 18.31,59.92 U$5.3
XCOARSE_IN  (via drill 0.41)
  Top 0.178: v13.07,50.76 13.42,51.12 13.42,54.14 R5.1 | v16,47.83 16.54,47.83 17.07,47.3 18.05,47.3 IC3.5 18.14,47.21 18.58,47.21 20.62,45.16 v20.62,29.52 | v18.49,20.98 18.14,20.62 16.98,20.62 U$1.P38
  Bottom 0.178: v16,47.83 v13.07,50.76 | v18.49,20.98 17.42,22.05 17.42,25.16 20.62,28.36 v20.62,29.52
XDUAL_OUT  (via drill 0.41)
  Top 0.178: R6.2 12,55.92 13.42,55.92 R5.2 13.51,55.83 14.94,55.83 C4.1 15.02,55.92 15.47,56.36 v15.47,57.07 | v19.82,61.07 22.23,61.07 23.29,60.01 24.27,60.01 U$2.3
  Bottom 0.178: v19.82,61.07 16.71,57.96 16.36,57.96 v15.47,57.07
XFINE_IN  (via drill 0.41)
  Top 0.178: R6.1 11.91,54.14 11.91,51.56 10.58,50.23 10.58,49.43 11.38,48.63 11.91,48.63 IC3.9 12,48.63 16.27,48.63 16.98,47.92 19.2,47.92 21.69,45.43 v21.69,29.07 | v18.22,22.4 18.22,21.78 17.6,21.16 16.98,21.16 U$1.P39
  Bottom 0.178: v18.22,22.4 18.22,25.43 21.69,28.89 v21.69,29.07
YBARDUAL_OUT
  Top 0.178: R12.2 2.58,55.92 3.91,55.92 R11.2 4.09,55.83 5.42,55.83 C7.1 5.42,55.92 5.42,59.38 5.96,59.92 6.22,59.92 U$6.3
YCOARSE_IN
  Top 0.178: R7.1 8.45,54.23 7.64,55.03 1.96,55.03 1.6,54.67 1.6,53.61 7.11,48.09 9.34,48.09 11.38,46.05 11.91,46.05 IC3.11 11.29,46.05 10.49,45.25 10.49,40.89 14.76,36.63 14.76,28.98 15.91,27.83 15.91,26.31 12,22.4 10.58,22.4 9.78,21.6 8.53,21.6 U$1.P21
YDUAL_OUT
  Top 0.178: R8.2 7.02,55.92 8.45,55.92 R7.2 8.53,55.83 9.96,55.83 C5.1 10.05,55.92 10.58,56.45 10.58,58.59 11.91,59.92 12.27,59.92 U$4.3
YFINE_IN  (via drill 0.41)
  Top 0.178: v10.31,51.03 10.13,51.03 7.02,54.14 R8.1 | IC3.13 12,43.47 12.45,43.47 12.47,43.5 15.5,43.5 | v13.05,22.13 12.71,22.05 10.76,22.05 9.87,21.16 8.53,21.16 U$1.P22 | v19.02,29.69 19.02,40.8 18.31,41.52 16.48,41.52 16,42 16,43 15.5,43.5 | v13.6,47.74 13.76,47.74 15.5,46 15.5,43.5
  Bottom 0.178: v13.6,47.74 v10.31,51.03 | v13.05,22.13 14,23 14,24.71 14.05,24.71 v19.02,29.69